# Altium schematic sheet 3V3_Isolation.SchDoc
size A
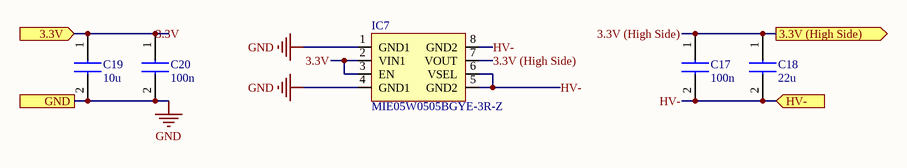
[diagram p0: 3V3_Isolation.SchDoc]

## Parts
C17  100n  [CAPC3216X94N]
C18  22u  [CAPC3216X180N]
C19  10u  [CAPC3216X180N]
C20  100n  [CAPC3216X94N]
IC7  MIE05W0505BGYE-3R-Z  [SOIC127P1030X265-8N]

## Ports
3.3V (High Side) (out), 3.3V (in), GND, HV- (in)

## Nets
GND: C19.2 C20.2 IC7.1(GND1) IC7.4(GND1) ; port GND
3.3V: C19.1 C20.1 IC7.2(VIN1) IC7.3(EN) ; port 3.3V
3.3V (High Side): C17.1 C18.1 IC7.7(VOUT) ; port 3.3V (High Side)
HV-: C17.2 C18.2 IC7.5(GND2) IC7.6(VSEL) IC7.8(GND2) ; port HV-

## Library data of the parts
C17 C20 = 12065C104J4Z2A: Capacitor; Manufacturer_Name: Kyocera AVX; Datasheet Link: https://spicat.kyocera-avx.com/product/mlcc/chartview/12065C104J4Z2A/DataSheet/X7R; Height: 0.94mm; Manufacturer_Part_Number: 12065C104J4Z2A; Mouser Part Number: 581-12065C104J4Z2A; Mouser Price/Stock: https://www.mouser.com/Search/Refine.aspx?Keyword=581-12065C104J4Z2A
C18 = GGM31CD70J226KE02L: Capacitor; Manufacturer_Name: Murata Electronics; Datasheet Link: https://search.murata.co.jp/Ceramy/image/img/A01X/G101/ENG/GGM31CD70J226KE02-01.pdf; Height: 1.8mm; Manufacturer_Part_Number: GGM31CD70J226KE02L
C19 = MLASU31LBB5106KTNA01: Capacitor; Manufacturer_Name: TAIYO YUDEN; Datasheet Link: https://mm.digikey.com/Volume0/opasdata/d220001/medias/docus/5731/MLR01_e.pdf; Height: 1.8mm; Manufacturer_Part_Number: MLASU31LBB5106KTNA01